# EasyEDA Pro project ProProject_触摸滑条_2026-03-11.epro

# Board PCB1
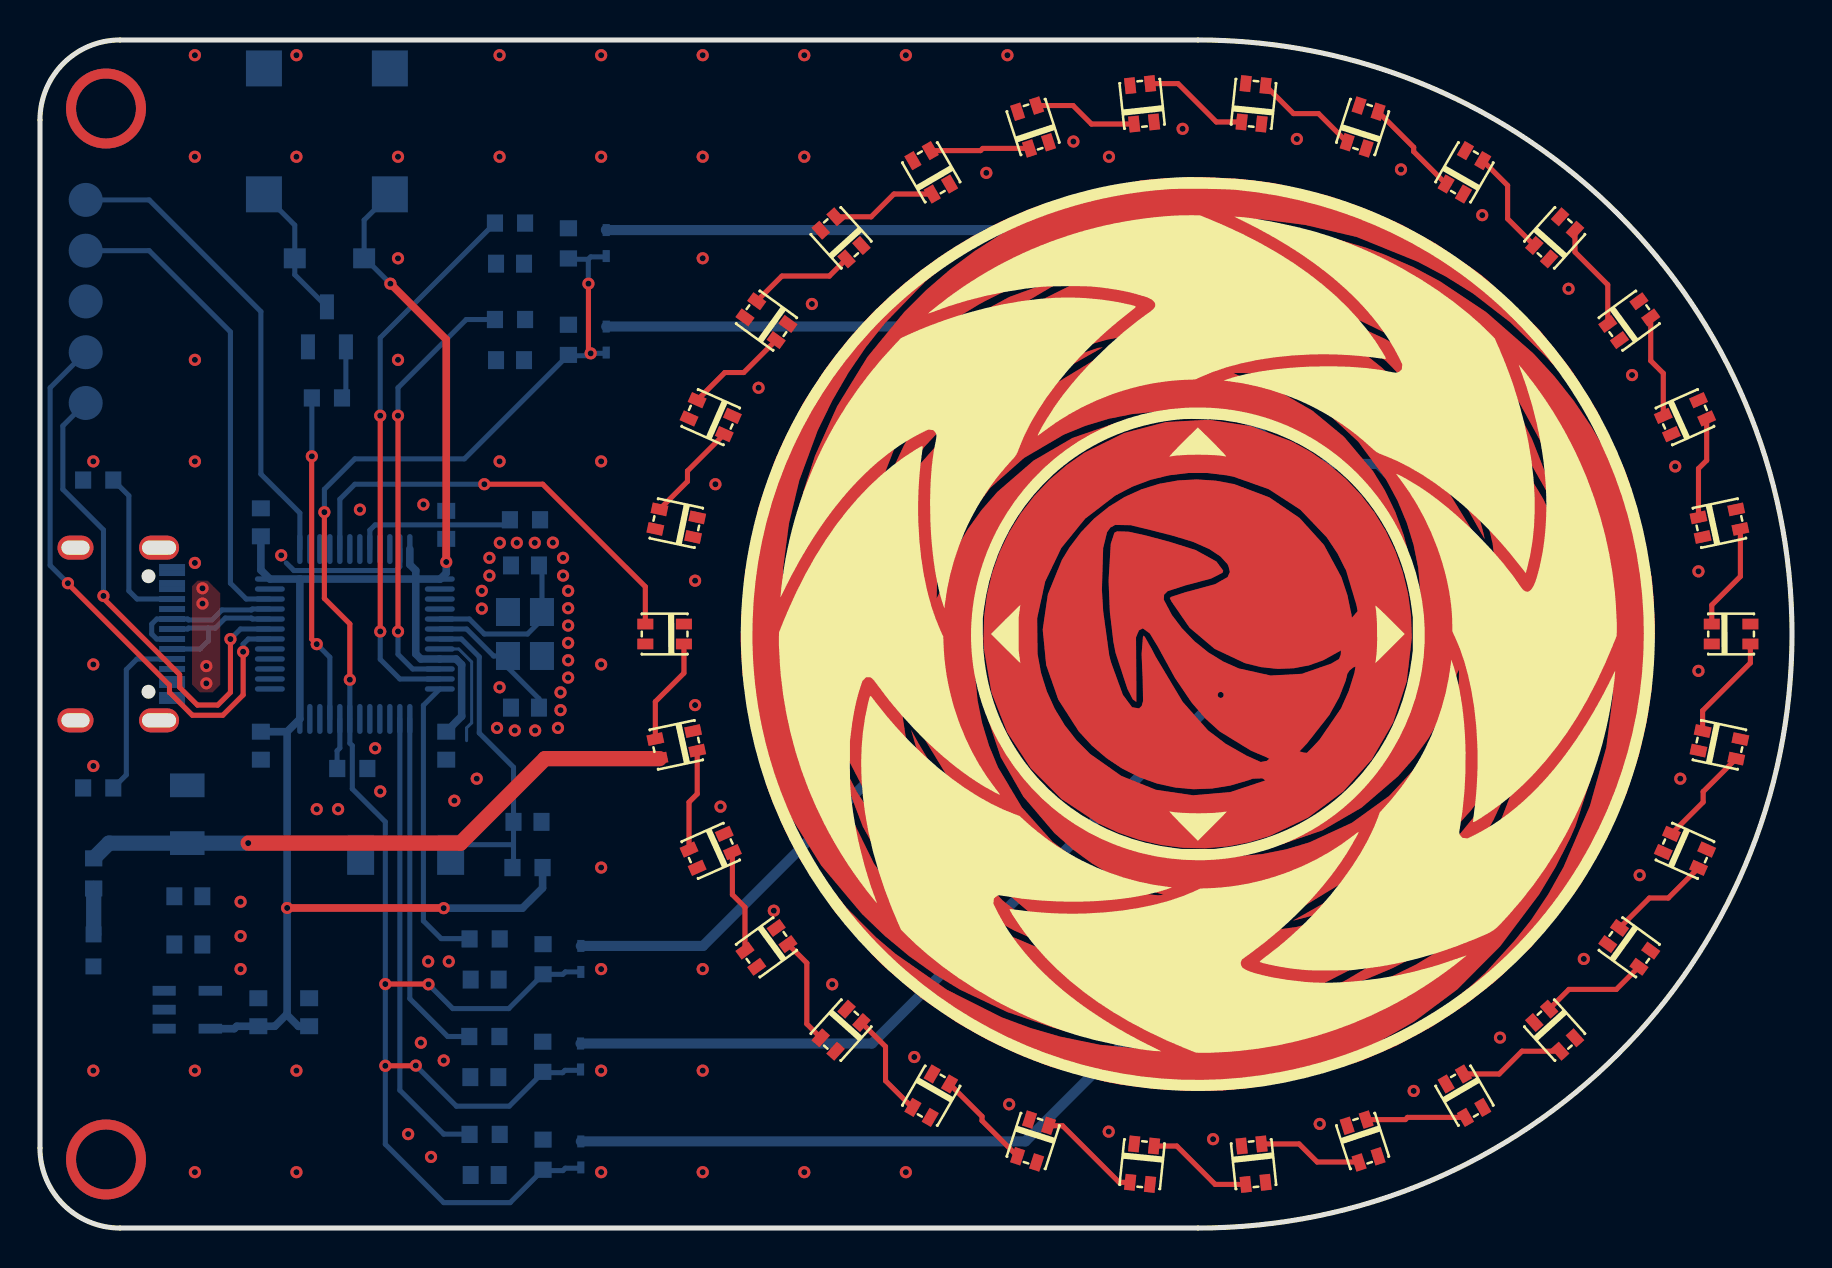
[diagram p0: board, top side]
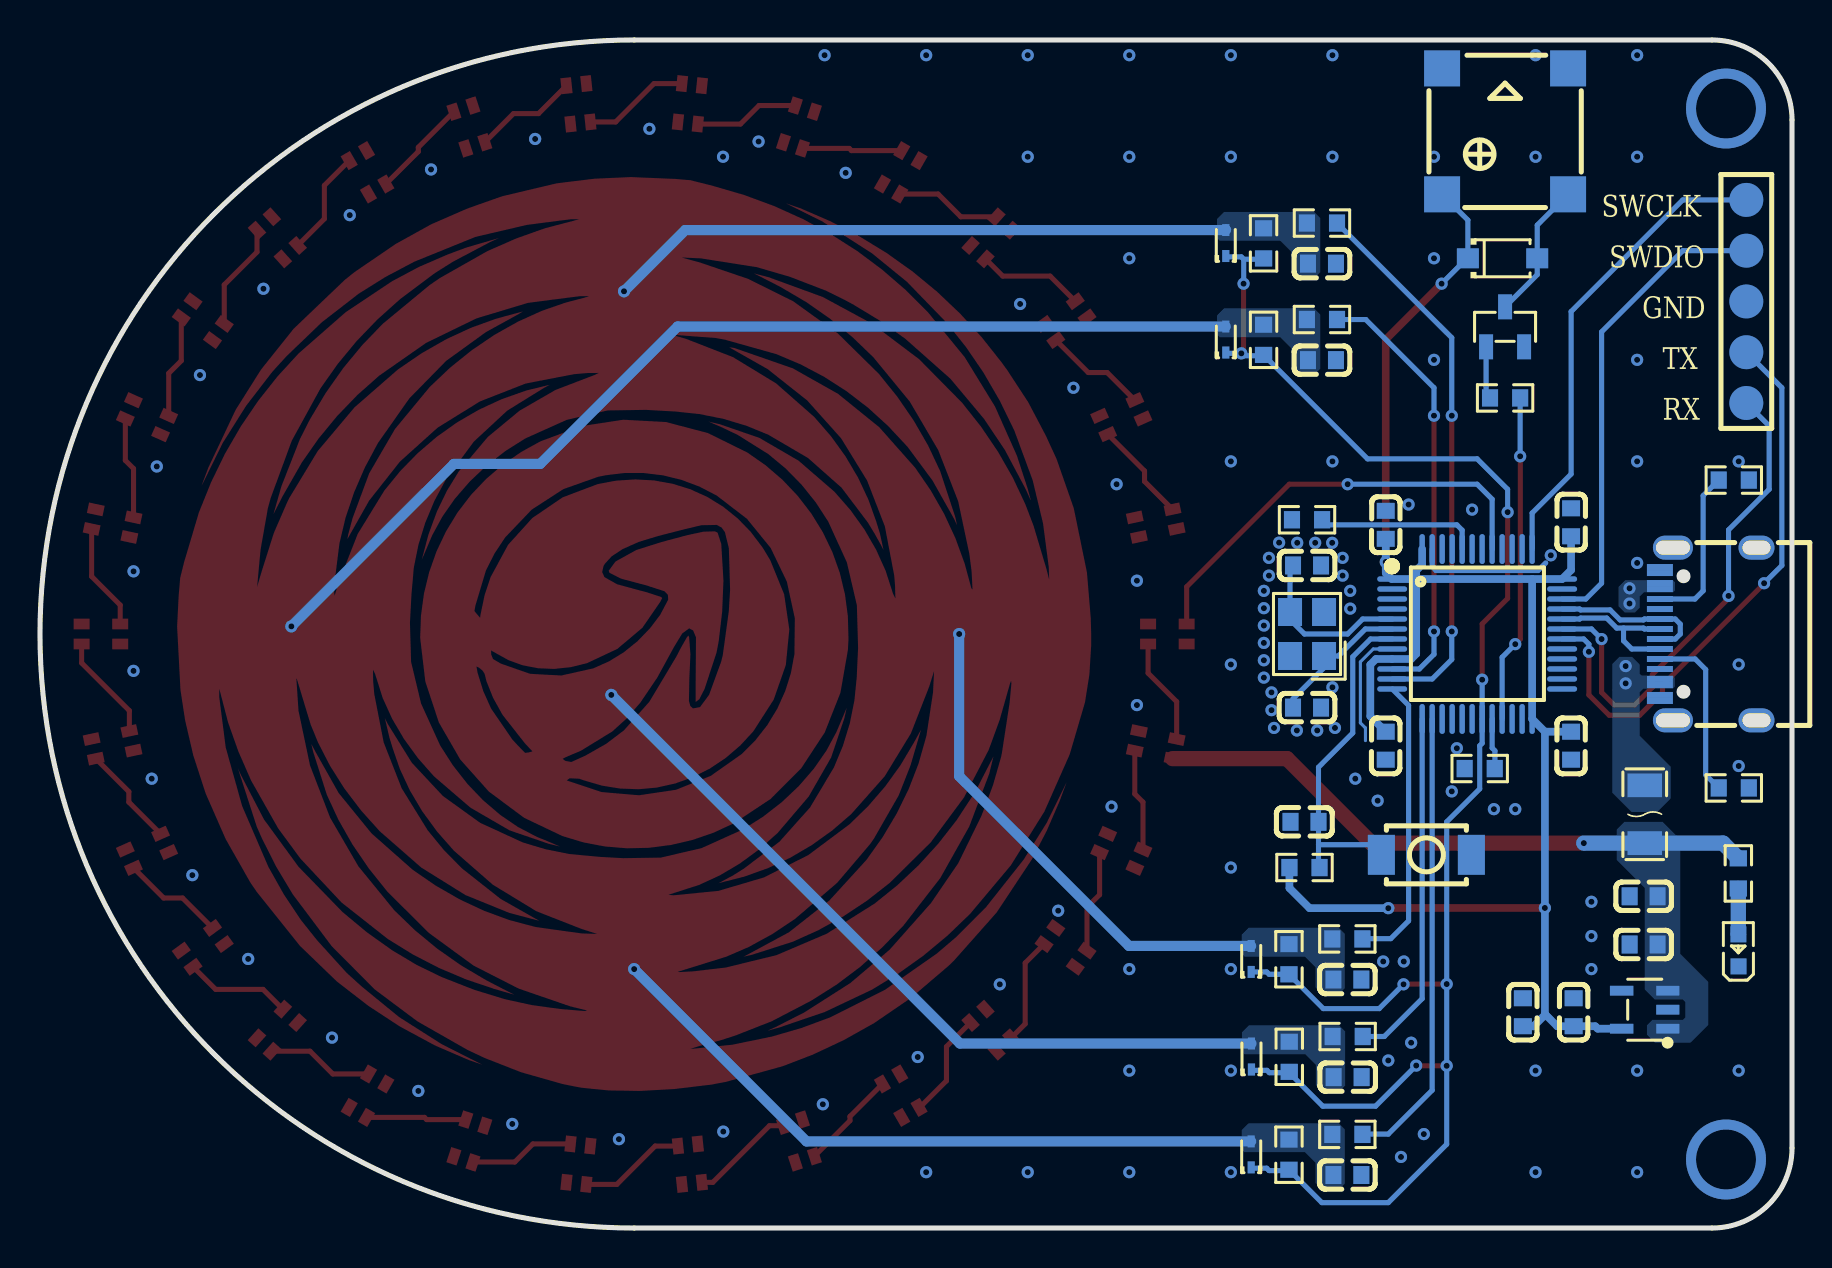
[diagram p1: board, bottom side, seen from below]

Outline 87.63 x 59.44 mm; copper layers: Top Layer, Bottom Layer. Coordinates in mm from the lower left corner of the outline.
Outline path: 0,55.44 0,4 arc(1.17,1.17) 4,0 57.91,0 arc(87.63,29.72) 57.91,59.44 4,59.44 arc(1.17,58.26) 0,55.44
Stack: Top Layer 0.035mm / Dielectric1 1.51mm FR4 er 4.5 / Bottom Layer 0.035mm

## Design rules (mm)
net DN: DP1
net DP: DP1
template: 自定义配置
spacing copperThickness1oz (default): track to track 0.102, other pairs 0.152 to 0.3
spacing copperThickness2oz: track to track 0.203, other pairs 0.152 to 0.3
track width copperThickness1oz (default): min 0.127, default 0.254, max 2.54
track width copperThickness2oz: min 0.203, default 0.254, max 2.54
differential pair differentialPair (default): width min 0.127, default 0.254, max 2.54; gap min 0.152, default 0.152
via viaSize (default): diameter min 0.5, default 0.61, max 10; hole min 0.3, default 0.305, max 6.3

## Placement (name value [footprint] x y rotation side)
BUZZER1  SMD-7525  [BUZ-SMD_4P-L7.5-W7.5-BR]  14.35 54.86 270 bottom
C9  100nF  [C0603]  24.38 20.32 180 bottom
C10  22pF  [C0603]  24.26 33.15 180 bottom
C11  22pF  [C0603]  24.26 26.03 180 bottom
C16  100nF  [C0603]  20.32 24.13 90 bottom
C17  100nF  [C0603]  11.05 35.31 270 bottom
C18  100nF  [C0603]  11.05 24.13 90 bottom
C19  100nF  [C0603]  20.32 35.18 270 bottom
C20  10nF  [C0603]  7.42 16.6 0 bottom
C21  1uF  [C0603]  10.92 10.79 90 bottom
C22  10nF  [C0603]  13.46 10.79 90 bottom
C23  1uF  [C0603]  7.42 14.18 0 bottom
C24  NC  [C0603]  23.51 48.24 0 bottom
C25  NC  [C0603]  23.51 43.42 0 bottom
C26  NC  [C0603]  22.24 12.43 0 bottom
C27  NC  [C0603]  22.23 7.55 0 bottom
C28  NC  [C0603]  22.24 2.65 0 bottom
D2  1N4148W  [SOD-123F_L2.7-W1.6-LS3.8-RD]  14.48 48.51 180 bottom
LED2  -  [LED_0603]  2.69 13.94 90 bottom
LED3  WS2812-2020  [LED-SMD_L2.2-W2.0]  31.24 29.72 0 top
LED4  WS2812-2020  [LED-SMD_L2.2-W2.0]  31.83 24.17 12 top
LED5  WS2812-2020  [LED-SMD_L2.2-W2.0]  33.55 18.87 24 top
LED6  WS2812-2020  [LED-SMD_L2.2-W2.0]  36.34 14.04 36 top
LED7  WS2812-2020  [LED-SMD_L2.2-W2.0]  40.07 9.9 48 top
LED8  WS2812-2020  [LED-SMD_L2.2-W2.0]  44.58 6.62 60 top
LED9  WS2812-2020  [LED-SMD_L2.2-W2.0]  49.67 4.35 72 top
LED10  WS2812-2020  [LED-SMD_L2.2-W2.0]  55.12 3.19 84 top
LED11  WS2812-2020  [LED-SMD_L2.2-W2.0]  60.7 3.19 96 top
LED12  WS2812-2020  [LED-SMD_L2.2-W2.0]  66.15 4.35 108 top
LED13  WS2812-2020  [LED-SMD_L2.2-W2.0]  71.25 6.62 120 top
LED14  WS2812-2020  [LED-SMD_L2.2-W2.0]  75.76 9.9 132 top
LED15  WS2812-2020  [LED-SMD_L2.2-W2.0]  79.49 14.04 144 top
LED16  WS2812-2020  [LED-SMD_L2.2-W2.0]  82.28 18.87 156 top
LED17  WS2812-2020  [LED-SMD_L2.2-W2.0]  84 24.17 168 top
LED18  WS2812-2020  [LED-SMD_L2.2-W2.0]  84.58 29.72 180 top
LED19  WS2812-2020  [LED-SMD_L2.2-W2.0]  84 35.26 192 top
LED20  WS2812-2020  [LED-SMD_L2.2-W2.0]  82.28 40.57 204 top
LED21  WS2812-2020  [LED-SMD_L2.2-W2.0]  79.49 45.39 216 top
LED22  WS2812-2020  [LED-SMD_L2.2-W2.0]  75.76 49.54 228 top
LED23  WS2812-2020  [LED-SMD_L2.2-W2.0]  71.25 52.81 240 top
LED24  WS2812-2020  [LED-SMD_L2.2-W2.0]  66.15 55.08 252 top
LED25  WS2812-2020  [LED-SMD_L2.2-W2.0]  60.7 56.24 264 top
LED26  WS2812-2020  [LED-SMD_L2.2-W2.0]  55.12 56.24 276 top
LED27  WS2812-2020  [LED-SMD_L2.2-W2.0]  49.67 55.08 288 top
LED28  WS2812-2020  [LED-SMD_L2.2-W2.0]  44.58 52.81 300 top
LED29  WS2812-2020  [LED-SMD_L2.2-W2.0]  40.07 49.54 312 top
LED30  WS2812-2020  [LED-SMD_L2.2-W2.0]  36.34 45.39 324 top
LED31  WS2812-2020  [LED-SMD_L2.2-W2.0]  33.55 40.57 336 top
LED32  WS2812-2020  [LED-SMD_L2.2-W2.0]  31.83 35.26 348 top
Q3  SS8050  [SOT-23-3_L2.9-W1.3-P1.90-LS2.4-BR]  14.35 45.08 270 bottom
R1  10K  [r0603]  24.26 35.43 0 bottom
R2  10K  [r0603]  15.62 22.99 0 bottom
R3  10kΩ  [r0603]  24.38 18.03 0 bottom
R4  5K1  [R0603]  2.91 37.42 0 bottom
R5  5K1  [R0603]  2.91 22.02 0 bottom
R7  5K1  [R0603]  2.69 17.74 270 bottom
R8  180  [R0603]  14.35 41.53 0 bottom
R9  0  [R0603]  23.51 50.28 180 bottom
R10  1M  [R0603]  26.43 49.26 90 bottom
R11  0  [R0603]  23.51 45.45 180 bottom
R12  1M  [R0603]  26.43 44.43 90 bottom
R13  0  [R0603]  22.24 14.46 180 bottom
R14  1M  [R0603]  25.16 13.45 90 bottom
R15  0  [R0603]  22.23 9.58 180 bottom
R16  1M  [R0603]  25.15 8.57 90 bottom
R17  0  [R0603]  22.24 4.68 180 bottom
R18  1M  [R0603]  25.16 3.67 90 bottom
SW3  -  [烧录焊盘5p]  2.29 46.35 270 bottom
SW8  GT-TC029B-H020-L1N  [SW-SMD_L3.9-W2.9-P4.15-LS5.0]  18.29 18.67 180 bottom
U2  1.5A快恢复保险丝-1206  [F1206]  7.37 20.7 270 bottom
U3  STM32F103C8T6  [LQFP-48_L7.0-W7.0-P0.50-LS9.0-BL]  15.75 29.72 270 bottom
U40  RT9013-33GB  [SOT-23-5_L3.0-W1.7-P0.95-LS2.8-BL]  7.37 10.92 90 bottom
U41  B5819WT  [SOD-523_L1.2-W0.8-LS1.6-RD]  28.32 49.28 90 bottom
U42  B5819WT  [SOD-523_L1.2-W0.8-LS1.6-RD]  28.32 44.45 90 bottom
U43  B5819WT  [SOD-523_L1.2-W0.8-LS1.6-RD]  27.05 13.46 90 bottom
U44  B5819WT  [SOD-523_L1.2-W0.8-LS1.6-RD]  27.04 8.58 90 bottom
U45  B5819WT  [SOD-523_L1.2-W0.8-LS1.6-RD]  27.05 3.68 90 bottom
USB1  typec  [USB-C-SMD_KH-TYPE-C-16P]  4.19 29.72 90 bottom
X2  8MHz  [CRYSTAL-SMD_4P-L3.2-W2.5-BL]  24.26 29.72 90 bottom

## Footprints (pads in the part's own frame, mm; a bottom-side part is the same pattern mirrored in y, then rotated)
BUZ-SMD_4P-L7.5-W7.5-BR
  rect 1.8x1.8 smd: 1(3.15,-3.15) 2(3.15,3.15) 3(-3.15,3.15) 4(-3.15,-3.15)
C0603
  rect 0.8x0.9 smd: 1(-0.7,0) 2(0.7,0)
CRYSTAL-SMD_4P-L3.2-W2.5-BL
  rect 1.4x1.2 smd: 1(-1.1,-0.85) 2(1.1,-0.85) 3(1.1,0.85) 4(-1.1,0.85)
F1206
  rect 1.19x1.728 smd: 1(-1.445,0) 2(1.445,0)
LED-SMD_L2.2-W2.0
  rect 0.8x0.535 smd: 1(0.965,-0.5) 2(0.965,0.5) 3(-0.965,0.5) 4(-0.965,-0.5)
LED_0603
  rect 0.8x0.8 smd: 1(-0.851,-0.01) 2(0.75,-0.005)
LQFP-48_L7.0-W7.0-P0.50-LS9.0-BL
  oval 0.27x1.5 smd: 1(-2.75,-4.25) 2(-2.25,-4.25) 3(-1.75,-4.25) 4(-1.25,-4.25) 5(-0.75,-4.25) 6(-0.25,-4.25) 7(0.25,-4.25) 8(0.75,-4.25) 9(1.25,-4.25) 10(1.75,-4.25) 11(2.25,-4.25) 12(2.75,-4.25) 25(2.75,4.25) 26(2.25,4.25) 27(1.75,4.25) 28(1.25,4.25) 29(0.75,4.25) 30(0.25,4.25) 31(-0.25,4.25) 32(-0.75,4.25) 33(-1.25,4.25) 34(-1.75,4.25) 35(-2.25,4.25) 36(-2.75,4.25)
  oval 1.5x0.27 smd: 13(4.25,-2.75) 14(4.25,-2.25) 15(4.25,-1.75) 16(4.25,-1.25) 17(4.25,-0.75) 18(4.25,-0.25) 19(4.25,0.25) 20(4.25,0.75) 21(4.25,1.25) 22(4.25,1.75) 23(4.25,2.25) 24(4.25,2.75) 37(-4.25,2.75) 38(-4.25,2.25) 39(-4.25,1.75) 40(-4.25,1.25) 41(-4.25,0.75) 42(-4.25,0.25) 43(-4.25,-0.25) 44(-4.25,-0.75) 45(-4.25,-1.25) 46(-4.25,-1.75) 47(-4.25,-2.25) 48(-4.25,-2.75)
r0603
  rect 0.806x0.864 smd: 1(-0.753,0) 2(0.753,0)
R0603
  rect 0.806x0.864 smd: 1(-0.753,0) 2(0.753,0)
SOD-123F_L2.7-W1.6-LS3.8-RD
  rect 1.1x1 smd: 1(-1.735,0) 2(1.735,0)
SOD-523_L1.2-W0.8-LS1.6-RD
  rect 0.6x0.36 smd: 1(-0.65,0) 2(0.65,0)
SOT-23-3_L2.9-W1.3-P1.90-LS2.4-BR
  rect 1.25x0.7 smd: 1(1,-0.95) 2(1,0.95) 3(-1,0)
SOT-23-5_L3.0-W1.7-P0.95-LS2.8-BL
  rect 0.49x1.157 smd: 1(-0.95,-1.153) 2(0,-1.153) 3(0.95,-1.153)
  rect 0.49x1.175 smd: 4(0.95,1.153) 5(-0.95,1.153)
SW-SMD_L3.9-W2.9-P4.15-LS5.0
  rect 1.35x2 smd: 1(-2.25,0) 2(2.25,0)
USB-C-SMD_KH-TYPE-C-16P
  oval 1.2x2 hole 0.7x1.7: 1(-4.32,1.765) 2(4.32,1.765)
  oval 1.2x1.8 hole 0.7x1.4: 3(-4.32,-2.415) 4(4.32,-2.415)
  rect 0.3x1.3 smd: A1(-3.35,2.415) A4(-2.55,2.415) A5(-1.25,2.415) A6(-0.25,2.415) A7(0.25,2.415) A8(1.25,2.415) A9(2.55,2.415) A12(3.35,2.415) B1(3.05,2.415) B4(2.25,2.415) B5(1.75,2.415) B6(0.75,2.415) B7(-0.75,2.415) B8(-1.75,2.415) B9(-2.25,2.415) B12(-3.05,2.415)
烧录焊盘5p
  round 1.7 smd: 1(-5.08,0) 2(-2.54,0) 3(0,0) 4(2.54,0) 5(5.08,0)

## Nets
3V3: BUZZER1.1 C16.2 C17.2 C18.2 C19.2 C21.1 C22.1 D2.1 R3.2 U3.1 U3.9 U3.24 U3.36 U3.48 U40.5
5V: C20.1 C23.1 LED3.4 LED4.4 LED5.4 LED6.4 LED7.4 LED8.4 LED9.4 LED10.4 LED11.4 LED12.4 LED13.4 LED14.4 LED15.4 LED16.4 LED17.4 LED18.4 LED19.4 LED20.4 LED21.4 LED22.4 LED23.4 LED24.4 LED25.4 LED26.4 LED27.4 LED28.4 LED29.4 LED30.4 LED31.4 LED32.4 R7.1 U2.2 U40.1 U40.3
GND: C9.1 C10.2 C11.2 C16.1 C17.1 C18.1 C19.1 C20.2 C21.2 C22.2 C23.2 C24.1 C25.1 C26.1 C27.1 C28.1 LED2.1 LED3.2 LED4.2 LED5.2 LED6.2 LED7.2 LED8.2 LED9.2 LED10.2 LED11.2 LED12.2 LED13.2 LED14.2 LED15.2 LED16.2 LED17.2 LED18.2 LED19.2 LED20.2 LED21.2 LED22.2 LED23.2 LED24.2 LED25.2 LED26.2 LED27.2 LED28.2 LED29.2 LED30.2 LED31.2 LED32.2 Q3.2 R1.2 R2.2 R4.1 R5.1 SW3.3 SW8.2 U3.8 U3.23 U3.35 U3.47 U40.2 USB1.1 USB1.2 USB1.3 USB1.4 USB1.A1 USB1.B12
VCC_IN: U2.1 USB1.A4 USB1.A9 USB1.B4 USB1.B9
ADC1: R9.2 U3.11
ADC2: R11.2 U3.10
ADC3: R13.2 U3.12
ADC4: R15.2 U3.13
ADC5: R17.2 U3.14
BOOT0: R1.1 U3.44
BOOT1: R2.1 U3.20
BUZZER: R8.1 U3.21
CC1: R5.2 USB1.A5
CC2: R4.2 USB1.B5
DN: U3.32 USB1.A7 USB1.B7
DP: U3.33 USB1.A6 USB1.B6
NRST: C9.2 R3.1 SW8.1 U3.7
OSC_IN: C10.1 U3.5 X2.3
OSC_OUT: C11.1 U3.6 X2.1
PA5: U3.15
PA6: U3.16
PA7: U3.17
PA8: U3.29
PA9: SW3.4 U3.30
PA10: SW3.5 U3.31
PA13: SW3.2 U3.34
PA14: SW3.1 U3.37
PA15: U3.38
PB0: U3.18
PB1: R10.1 R12.1 R14.1 R16.1 R18.1 U3.19 U41.1 U42.1 U43.1 U44.1 U45.1
PB3: U3.39
PB4: U3.40
PB5: LED3.3 U3.41
PB6: U3.42
PB7: U3.43
PB8: U3.45
PB9: U3.46
PB11: U3.22
PB12: U3.25
PB13: U3.26
PB14: U3.27
PB15: U3.28
PC13: U3.2
PC14: U3.3
PC15: U3.4
TOUCH_PAD1: C24.2 R9.1 R10.2 U41.2
TOUCH_PAD2: C25.2 R11.1 R12.2 U42.2
TOUCH_PAD3: C26.2 R13.1 R14.2 U43.2
TOUCH_PAD4: C27.2 R15.1 R16.2 U44.2
TOUCH_PAD5: C28.2 R17.1 R18.2 U45.2
$1N1629: USB1.A12 USB1.B1
$1N1656: LED2.2 R7.2
$1N2654: LED3.1 LED4.3
$1N2848: LED4.1 LED5.3
$1N2853: LED5.1 LED6.3
$1N2858: LED6.1 LED7.3
$1N2941: LED7.1 LED8.3
$1N3309: LED9.1 LED10.3
$1N3321: LED10.1 LED11.3
$1N3325: LED11.1 LED12.3
$1N3329: LED12.1 LED13.3
$1N3338: LED13.1 LED14.3
$1N3712: LED15.1 LED16.3
$1N3724: LED16.1 LED17.3
$1N3728: LED17.1 LED18.3
$1N3732: LED18.1 LED19.3
$1N3741: LED19.1 LED20.3
$1N3759: LED8.1 LED9.3
$1N3766: LED14.1 LED15.3
$1N4148: LED21.1 LED22.3
$1N4160: LED22.1 LED23.3
$1N4164: LED23.1 LED24.3
$1N4168: LED24.1 LED25.3
$1N4174: LED25.1 LED26.3
$1N4178: LED20.1 LED21.3
$1N5905: LED27.1 LED28.3
$1N5912: LED28.1 LED29.3
$1N5913: LED29.1 LED30.3
$1N5914: LED30.1 LED31.3
$1N5917: LED31.1 LED32.3
$1N5942: LED26.1 LED27.3
$1N7770: BUZZER1.2 D2.2 Q3.3
$1N7771: Q3.1 R8.2

Pads without a net: BUZZER1 3 4; LED32 1; U40 4; USB1 A8 B8; X2 2 4

## Via types
v1: diameter 4, hole 3, Top Layer to Bottom Layer, 2 vias
v2: diameter 0.61, hole 0.305, Top Layer to Bottom Layer, 145 vias

## Routing (per net, layer and track width the routed paths; a pad name or vN(x,y) marks a point on that pad's centre or on a via; arc(x,y) is an arc through that point)
3V3: length 88.3
  Top Layer w0.381: v2(12.36,16.01) 20.18,16.01 v2(20.19,16) ; v2(20.32,33.32) 20.32,44.45 v2(17.53,47.24)
  Bottom Layer w0.254: BUZZER1.1 16.21,50.43 D2.1 16.26,48.51 v2(17.53,47.24)
  Bottom Layer w0.381: 18.8,32.47 18.8,32.89 18.5,33.19 U3.48 ; 18.8,32.47 13,32.47 ; 18.8,32.47 20.02,32.47 20.32,32.77 v2(20.32,33.32) C19.2 ; 18.8,32.47 18.8,28.72 19.05,28.47 U3.9 20.81,28.47 21.09,28.18 21.09,25.6 C16.2 ; 12.33,10.68 12.36,10.71 12.36,24.83 ; 12.33,10.68 12.93,10.09 13.46,10.09 C22.1 ; 12.33,10.68 11.75,10.09 C21.1 9.84,10.09 9.72,9.97 U40.5 ; v2(20.19,16) 24.13,16 25.14,17.01 R3.2 ; 12.36,24.83 U3.24 13,32.47 ; 12.36,24.83 C18.2 ; 13,32.47 U3.36 11.05,32.92 C17.2
5V: length 30.4
  Top Layer w0.762: v2(10.41,19.26) 21.03,19.26 25.26,23.48 30.99,23.48
  Bottom Layer w0.762: R7.1 3.45,19.26 U2.2 v2(10.41,19.26)
GND: length 12.7
  Bottom Layer w0.152: 21.34,24.38 21.34,25.02 21.59,25.27 21.59,28.32 20.94,28.97 U3.8
  Bottom Layer w0.254: U3.47 18,33.09 17.8,32.89 12.7,32.89 12.32,33.27
  vias: v2(2.67,38.35) v2(2.67,28.19) v2(2.67,23.11) v2(2.67,7.87) v2(7.75,58.67) v2(7.75,53.59) v2(7.75,43.43) v2(7.75,38.35) v2(7.75,33.27) v2(7.75,7.87) v2(7.75,2.79) v2(10.03,16.32) v2(10.03,14.6) v2(10.03,12.95) v2(12.07,33.65) v2(12.83,58.67) v2(12.83,53.59) v2(12.83,7.87) v2(12.83,2.79) v2(13.84,20.95) v2(14.91,20.95) v2(16,35.94) v2(16.76,24) v2(17.02,21.84) v2(17.91,53.59) v2(17.91,48.51) v2(17.91,43.43) v2(18.42,4.7) v2(19.05,9.27) v2(19.18,36.19) v2(19.42,13.33) v2(19.56,3.56) v2(20.19,8.38) v2(20.45,13.33) v2(20.73,21.38) v2(21.84,22.48) v2(22.1,31.88) v2(22.1,30.99) v2(22.48,33.53) v2(22.48,32.64) v2(22.86,25.02) v2(22.99,58.67) v2(22.99,53.59) v2(22.99,38.35) v2(23,34.28) v2(22.99,27.05) v2(23.75,24.89) v2(23.85,34.28) v2(24.75,34.28) v2(24.77,24.89) v2(25.65,34.29) v2(25.91,25.02) v2(26.03,26.8) v2(26.03,25.91) v2(26.16,33.53) v2(26.16,32.64) v2(26.42,31.88) v2(26.42,31.01) v2(26.42,30.14) v2(26.42,29.27) v2(26.42,28.4) v2(26.42,27.54) v2(28.07,58.67) v2(28.07,53.59) v2(28.07,38.35) v2(28.07,28.19) v2(28.07,18.03) v2(28.07,12.95) v2(28.07,7.87) v2(28.07,2.79) v2(32.77,32.38) v2(32.77,26.16) v2(33.15,58.67) v2(33.15,53.59) v2(33.15,48.51) v2(33.15,12.95) v2(33.15,7.87) v2(33.15,2.79) v2(33.78,37.21) v2(34.04,21.08) v2(35.94,42.04) v2(36.7,15.87) v2(38.23,58.67) v2(38.23,53.59) v2(38.23,2.79) v2(38.61,46.23) v2(39.62,12.19) v2(43.31,58.67) v2(43.31,2.79) v2(43.73,8.56) v2(47.33,52.79) v2(48.39,58.67) v2(48.47,6.19) v2(51.69,54.36) v2(53.45,4.82) v2(53.47,53.59) v2(57.15,54.99) v2(58.67,4.44) v2(62.87,54.48) v2(64.01,5.21) v2(68.07,52.96) v2(68.71,6.86) v2(72.14,50.67) v2(73.03,9.52) v2(76.45,46.99) v2(77.22,13.46) v2(79.63,42.67) v2(80.01,17.65) v2(81.79,38.1) v2(82.04,22.48) v2(82.95,32.85) v2(82.95,27.87)
VCC_IN:
  vias: v2(8.13,32) v2(8.13,31.24) v2(8.32,28.11) v2(8.32,27.25)
(no net):
  vias: v1(3.3,56.01) v1(3.3,3.43)
ADC1: length 27.6
  Top Layer w0.254: v2(17.02,40.64) v2(17.02,29.84)
  Bottom Layer w0.254: U3.11 18,27.47 17.02,28.45 v2(17.02,29.84) ; R9.2 17.02,44.54 v2(17.02,40.64)
ADC2: length 22
  Top Layer w0.254: v2(17.91,40.64) v2(17.91,29.84)
  Bottom Layer w0.254: U3.10 18.64,27.97 17.91,28.7 v2(17.91,29.84) ; v2(17.91,40.64) 17.91,42.04 21.32,45.45 R11.2
ADC3: length 14.6
  Bottom Layer w0.254: R13.2 21.47,14.48 20.07,14.48 19.18,15.37 19.18,26.15 U3.12
ADC4: length 17.8
  Bottom Layer w0.254: R15.2 20.39,9.58 18.5,11.47 U3.13
ADC5: length 23
  Bottom Layer w0.254: U3.14 18,6.89 20.19,4.7 21.47,4.7 R17.2
BOOT0: length 8.2
  Bottom Layer w0.254: R1.1 23.25,35.18 16.76,35.18 16.5,34.91 U3.44
BOOT1: length 2.5
  Bottom Layer w0.254: U3.20 15,24.01 14.86,23.88 14.86,23 R2.1
BUZZER: length 16.4
  Top Layer w0.254: 13.59,38.61 13.59,29.46 v2(13.84,29.21)
  Bottom Layer w0.254: U3.21 14.5,28.55 v2(13.84,29.21) ; R8.1 v2(13.6,38.61)
CC1: length 8.7
  Bottom Layer w0.254: USB1.A5 4.85,28.47 4.32,27.94 4.32,22.67 R5.2
CC2: length 8.2
  Bottom Layer w0.254: R4.2 4.45,36.64 4.45,31.88 4.85,31.47 USB1.B5
DN: length 7.8
  Bottom Layer w0.254: U3.32 10.62,30.47 10.57,30.51 9.27,30.51 8.77,30.01 8.43,30.01 ; 8.43,30.01 8.43,29.38 8.01,28.97 USB1.B7 ; 8.43,30.01 7.43,30.01 7.38,29.97 USB1.A7
DP: length 7.9
  Bottom Layer w0.254: U3.33 10.62,30.97 10.57,30.92 9.1,30.92 8.6,30.42 7.43,30.42 7.38,30.47 USB1.B6 5.84,30.47 5.59,30.21 5.59,29.72 5.84,29.46 6.6,29.46 USB1.A6
NRST: length 17
  Bottom Layer w0.254: 23.68,19.18 23.68,18.09 R3.1 ; 23.68,19.18 C9.2 23.68,23.05 21.97,24.76 21.97,28.57 21.08,29.47 U3.7 ; 23.68,19.18 21.05,19.18 SW8.1
OSC_IN: length 8.5
  Bottom Layer w0.254: U3.5 21.48,30.47 22.23,29.72 24.38,29.72 25.11,30.44 X2.3 25.11,33 C10.1
OSC_OUT: length 7.2
  Bottom Layer w0.254: U3.6 21.34,29.97 22.69,28.62 X2.1 23.41,28.03 24.96,26.48 C11.1
PA9: length 28.8
  Top Layer w0.254: v2(10.16,28.83) 10.16,26.67 9.14,25.65 7.62,25.65 6.48,26.8 6.48,27.16 1.4,32.24 v2(1.4,32.26)
  Bottom Layer w0.254: v2(1.4,32.26) 0.51,33.15 0.51,42.04 SW3.4 ; U3.30 10.42,29.47 10.16,29.21 v2(10.16,28.83)
PA10: length 25.1
  Top Layer w0.254: v2(9.53,29.46) 9.53,26.8 8.89,26.16 7.87,26.16 6.98,27.05 6.98,27.69 3.18,31.5 v2(3.18,31.62)
  Bottom Layer w0.254: v2(3.18,31.62) 3.18,34.92 1.14,36.96 1.14,40.13 SW3.5 ; v2(9.53,29.46) 10.03,29.97 U3.31
PA13: length 23.8
  Bottom Layer w0.254: U3.34 10.32,31.47 9.53,32.26 9.53,44.83 5.46,48.89 SW3.2
PA14: length 23.8
  Bottom Layer w0.254: SW3.1 5.46,51.43 11.05,45.85 11.05,37.72 13,35.77 U3.37
PB1: length 91.8
  Top Layer w0.254: v2(18.8,8.13) 18.78,8.11 v2(17.27,8.11) ; v2(27.43,47.24) 27.43,43.87 v2(27.54,43.76) ; v2(19.43,12.19) 19.42,12.2 v2(17.27,12.2) ; v2(15.5,27.43) 15.5,30.22 14.22,31.5 v2(14.22,35.81)
  Bottom Layer w0.254: 27.43,48.47 27.54,48.58 28.32,48.58 ; 27.43,48.47 26.43,48.47 ; 27.43,48.47 27.43,47.25 v2(27.43,47.24) ; U43.1 26.27,12.81 26.16,12.69 R14.1 23.45,10.98 20.65,10.98 v2(19.43,12.19) ; v2(15.5,27.43) U3.19 15.5,24.25 15.62,24.13 15.62,21.97 17.27,20.32 v2(17.27,12.2) v2(17.27,8.11) 17.27,4.19 20.19,1.27 23.52,1.27 R18.1 ; 25.16,2.87 26.16,2.87 26.27,2.99 27.05,2.99 ; R12.1 21.23,38.48 15.75,38.48 14.22,36.96 v2(14.22,35.81) ; 27.04,7.89 26.26,7.89 26.14,7.77 25.15,7.77 23.47,6.1 20.83,6.1 v2(18.8,8.13) ; 26.43,43.64 27.43,43.64 v2(27.54,43.76) 28.32,43.76
PB5: length 22.1
  Top Layer w0.254: LED3.3 30.28,32.08 25.15,37.21 v2(22.23,37.21)
  Bottom Layer w0.254: v2(22.23,37.21) 15.75,37.21 15,36.46 U3.41
TOUCH_PAD1: length 31.4
  Bottom Layer w0.508: v2(58.42,46.86) 55.36,49.93 U41.2 28.31,49.94
TOUCH_PAD2: length 52.9
  Bottom Layer w0.508: v2(75.06,30.1) 66.93,38.23 62.61,38.23 55.74,45.1 U42.2
TOUCH_PAD3: length 25.2
  Bottom Layer w0.508: v2(41.66,29.72) 41.66,22.61 33.16,14.11 U43.2
TOUCH_PAD4: length 39.2
  Bottom Layer w0.508: U44.2 41.62,9.23 v2(59.06,26.67)
TOUCH_PAD5: length 34.4
  Bottom Layer w0.508: U45.2 49.29,4.33 v2(57.91,12.95)
$1N1656: length 2.3
  Bottom Layer w0.762: R7.2 2.69,14.69 LED2.2
$1N2654: length 5.3
  Top Layer w0.254: 30.78,24.46 30.78,26.33 32.21,27.76 LED3.1
$1N2848: length 5.1
  Top Layer w0.254: LED4.1 32.87,21.72 32.46,21.31 32.46,18.93
$1N2853: length 5.2
  Top Layer w0.254: LED5.1 34.63,16.68 35.26,16.05 35.26,13.88
$1N2858: length 5.4
  Top Layer w0.254: LED6.1 38.35,13.26 38.35,10.21 39.05,9.52
$1N2941: length 5.3
  Top Layer w0.254: LED8.3 43.62,6.04 42.29,7.37 42.29,9.07 41.08,10.28
$1N3309: length 5.3
  Top Layer w0.254: LED10.3 53.97,2.29 51.14,5.12 LED9.1
$1N3321: length 5.4
  Top Layer w0.254: LED10.1 56.86,4.1 58.78,2.18 LED11.3
$1N3325: length 5.3
  Top Layer w0.254: LED12.3 65.96,3.3 63.88,3.3 62.98,4.21 LED11.1
$1N3329: length 5
  Top Layer w0.254: LED13.3 68.4,5.54 68.29,5.43 66.33,5.43
$1N3338: length 5.3
  Top Layer w0.254: LED14.3 74.12,8.85 72.99,7.71 LED13.1
$1N3712: length 5.2
  Top Layer w0.254: LED15.1 80.5,16.51 81.44,16.51 LED16.3
$1N3724: length 5.1
  Top Layer w0.254: LED16.1 83.19,21.31 83.19,21.83 84.84,23.48
$1N3728: length 5.3
  Top Layer w0.254: LED18.3 85.55,28.27 83.16,25.88 LED17.1
$1N3732: length 5.3
  Top Layer w0.254: 85.05,34.97 85.05,32.6 83.62,31.17 LED18.1
$1N3741: length 5.1
  Top Layer w0.254: LED19.1 82.95,37.99 83.36,38.4 83.36,40.5
$1N3759: length 5
  Top Layer w0.254: LED9.3 47.12,5.37 47.12,5.58 LED8.1
$1N3766: length 5.4
  Top Layer w0.254: LED14.1 76.47,11.94 78.84,11.94 LED15.3
$1N4148: length 5.4
  Top Layer w0.254: LED21.1 78.41,47.19 76.78,48.83 76.78,49.92
$1N4160: length 5.3
  Top Layer w0.254: LED23.3 73.41,52.16 73.41,50.49 LED22.1
$1N4164: length 5
  Top Layer w0.254: LED23.1 68.71,53.85 68.71,54.07 LED24.3
$1N4168: length 5.3
  Top Layer w0.254: LED25.3 62.69,55.75 63.95,55.75 LED24.1
$1N4174: length 5.4
  Top Layer w0.254: LED25.1 58.84,55.33 56.92,57.25 LED26.3
$1N4178: length 5.2
  Top Layer w0.254: 80.56,45.56 80.56,43.39 81.19,42.76 LED20.1
$1N5905: length 5
  Top Layer w0.254: LED28.3 47.04,53.9 47.15,54.01 49.49,54.01
$1N5912: length 5.3
  Top Layer w0.254: LED29.3 41.57,50.59 42.71,51.73 LED28.1
$1N5913: length 5.4
  Top Layer w0.254: LED29.1 39.48,47.62 37.11,47.62 LED30.3
$1N5914: length 5.2
  Top Layer w0.254: LED31.3 34.25,42.8 35.2,42.8 LED30.1
$1N5917: length 5.1
  Top Layer w0.254: LED31.1 32.39,37.88 32.39,37.35 30.99,35.95
$1N5942: length 5.3
  Top Layer w0.254: LED27.3 51.67,56.15 52.59,55.23 LED26.1
$1N7770: length 6.9
  Bottom Layer w0.254: BUZZER1.2 12.74,50.17 D2.2 12.74,47.69 Q3.3
$1N7771: length 2.6
  Bottom Layer w0.254: Q3.1 15.3,41.73 R8.2

## Copper pours and planes (outline as drawn; the poured copper is in the pictures)
5V on Top Layer: 87.24,30.24 87.21,31.29 87.13,32.33 87.02,33.37 86.87,34.41 86.69,35.44 86.46,36.46 86.2,37.48 85.91,38.48 85.58,39.48 85.21,40.46 84.81,41.43 84.38,42.38 83.91,43.32 83.41,44.24 82.87,45.14 82.3,46.02 81.71,46.88 81.08,47.72 80.42,48.53 79.74,49.32 79.02,50.09 78.28,50.83 77.52,51.54 76.72,52.23 75.91,52.89 75.07,53.51 74.21,54.11 73.33,54.68 72.43,55.21 71.51,55.71 70.57,56.18 69.62,56.62 68.65,57.02 67.67,57.38 66.68,57.71 65.67,58.01 64.66,58.27 63.64,58.49 62.6,58.68 61.57,58.83 60.53,58.94 59.48,59.01 58.44,59.05 57.39,59.05 56.34,59.01 55.3,58.94 54.26,58.83 53.22,58.68 52.19,58.49 51.17,58.27 50.15,58.01 49.15,57.71 48.15,57.38 47.17,57.02 46.2,56.62 45.25,56.18 44.31,55.71 43.39,55.21 42.49,54.68 41.61,54.11 40.75,53.51 39.91,52.89 39.1,52.23 38.31,51.54 37.54,50.83 36.8,50.09 36.09,49.32 35.4,48.53 34.74,47.72 34.12,46.88 33.52,46.02 32.95,45.14 32.42,44.24 31.92,43.32 31.45,42.38 31.01,41.43 30.61,40.46 30.25,39.48 29.92,38.48 29.62,37.48 29.36,36.46 29.14,35.44 28.95,34.41 28.8,33.37 28.69,32.33 28.62,31.29 28.58,30.24 28.58,29.19 28.62,28.15 28.69,27.1 28.8,26.06 28.95,25.03 29.14,23.99 29.36,22.97 29.62,21.96 29.92,20.95 30.25,19.96 30.61,18.98 31.01,18.01 31.45,17.06 31.92,16.12 32.42,15.2 32.95,14.3 33.52,13.42 34.12,12.56 34.74,11.72 35.4,10.91 36.09,10.11 36.8,9.35 37.54,8.61 38.31,7.89 39.1,7.21 39.91,6.55 40.75,5.92 41.61,5.33 42.49,4.76 43.39,4.22 44.31,3.72 45.25,3.25 46.2,2.82 47.17,2.42 48.15,2.05 49.15,1.72 50.15,1.43 51.17,1.17 52.19,0.94 53.22,0.76 54.26,0.61 55.3,0.5 56.34,0.42 57.39,0.39 58.44,0.39 59.48,0.42 60.53,0.5 61.57,0.61 62.6,0.76 63.64,0.94 64.66,1.17 65.67,1.43 66.68,1.72 67.67,2.05 68.65,2.42 69.62,2.82 70.57,3.25 71.51,3.72 72.43,4.22 73.33,4.76 74.21,5.33 75.07,5.92 75.91,6.55 76.72,7.21 77.52,7.89 78.28,8.61 79.02,9.35 79.74,10.11 80.42,10.91 81.08,11.72 81.71,12.56 82.3,13.42 82.87,14.3 83.41,15.2 83.91,16.12 84.38,17.06 84.81,18.01 85.21,18.98 85.58,19.96 85.91,20.95 86.2,21.96 86.46,22.97 86.69,23.99 86.87,25.03 87.02,26.06 87.13,27.1 87.21,28.15 87.24,29.19
5V on Bottom Layer: 4.19,20.32 8.76,20.32 8.76,9.27 4.19,9.27
GND on Top Layer: -4.7,64.52 87.25,64.52 87.25,-5.46 -4.7,-5.46
GND on Top Layer: 84.09,30.21 84.05,31.19 83.98,32.16 83.87,33.13 83.72,34.1 83.54,35.06 83.32,36.02 83.07,36.96 82.78,37.9 82.45,38.82 82.1,39.74 81.71,40.63 81.28,41.52 80.82,42.38 80.33,43.23 79.81,44.06 79.26,44.87 78.68,45.65 78.07,46.42 77.43,47.16 76.77,47.88 76.07,48.57 75.36,49.24 74.61,49.88 73.85,50.49 73.06,51.07 72.25,51.62 71.42,52.14 70.57,52.63 69.71,53.09 68.83,53.51 67.93,53.9 67.02,54.26 66.09,54.58 65.16,54.87 64.21,55.13 63.26,55.34 62.3,55.53 61.33,55.67 60.36,55.78 59.38,55.85 58.4,55.89 57.42,55.89 56.44,55.85 55.47,55.78 54.5,55.67 53.53,55.53 52.57,55.34 51.61,55.13 50.66,54.87 49.73,54.58 48.81,54.26 47.89,53.9 47,53.51 46.11,53.09 45.25,52.63 44.4,52.14 43.57,51.62 42.76,51.07 41.98,50.49 41.21,49.88 40.47,49.24 39.75,48.57 39.06,47.88 38.39,47.16 37.75,46.42 37.14,45.65 36.56,44.87 36.01,44.06 35.49,43.23 35,42.38 34.54,41.52 34.12,40.63 33.73,39.74 33.37,38.82 33.05,37.9 32.76,36.96 32.5,36.02 32.29,35.06 32.1,34.1 31.96,33.13 31.85,32.16 31.78,31.19 31.74,30.21 31.74,29.23 31.78,28.25 31.85,27.27 31.96,26.3 32.1,25.33 32.29,24.37 32.5,23.42 32.76,22.47 33.05,21.54 33.37,20.61 33.73,19.7 34.12,18.8 34.54,17.92 35,17.06 35.49,16.21 36.01,15.38 36.56,14.57 37.14,13.78 37.75,13.02 38.39,12.27 39.06,11.56 39.75,10.86 40.47,10.2 41.21,9.56 41.98,8.95 42.76,8.37 43.57,7.82 44.4,7.3 45.25,6.81 46.11,6.35 47,5.92 47.89,5.53 48.81,5.18 49.73,4.85 50.66,4.56 51.61,4.31 52.57,4.09 53.53,3.91 54.5,3.76 55.47,3.65 56.44,3.58 57.42,3.54 58.4,3.54 59.38,3.58 60.36,3.65 61.33,3.76 62.3,3.91 63.26,4.09 64.21,4.31 65.16,4.56 66.09,4.85 67.02,5.18 67.93,5.53 68.83,5.92 69.71,6.35 70.57,6.81 71.42,7.3 72.25,7.82 73.06,8.37 73.85,8.95 74.61,9.56 75.36,10.2 76.07,10.86 76.77,11.56 77.43,12.27 78.07,13.02 78.68,13.78 79.26,14.57 79.81,15.38 80.33,16.21 80.82,17.06 81.28,17.92 81.71,18.8 82.1,19.7 82.45,20.61 82.78,21.54 83.07,22.47 83.32,23.42 83.54,24.37 83.72,25.33 83.87,26.3 83.98,27.27 84.05,28.25 84.09,29.23
GND on Bottom Layer: -6.35,65.53 96.01,65.53 96.01,-7.37 -6.35,-7.37
VCC_IN on Top Layer: 7.61,32.38 9.02,32.38 9.02,26.8 7.61,26.8
VCC_IN on Bottom Layer: 7.53,28.57 8.98,28.57 8.98,26.82 7.53,26.82
VCC_IN on Bottom Layer: 5.86,27.64 8.98,27.64 8.98,20.81 5.86,20.81
VCC_IN on Bottom Layer: 5.85,32.41 8.68,32.41 8.68,30.8 5.85,30.8
TOUCH_PAD1 on Bottom Layer: 23.6,50.83 28.76,50.83 28.76,47.54 23.6,47.54
TOUCH_PAD2 on Bottom Layer: 23.6,46.01 28.76,46.01 28.76,42.71 23.6,42.71
TOUCH_PAD3 on Bottom Layer: 22.37,15.02 27.53,15.02 27.53,11.72 22.37,11.72
TOUCH_PAD4 on Bottom Layer: 22.35,10.14 27.51,10.14 27.51,6.84 22.35,6.84
TOUCH_PAD5 on Bottom Layer: 22.37,5.24 27.53,5.24 27.53,1.94 22.37,1.94

Small or netless copper shapes (teardrops, artwork), in the pictures only: 5 on Top Layer

## Text on the board
Bottom Silkscreen Layer: TX | RX | GND | SWDIO | SWCLK
Document Layer: DRC报错是正常的，不需要理会
